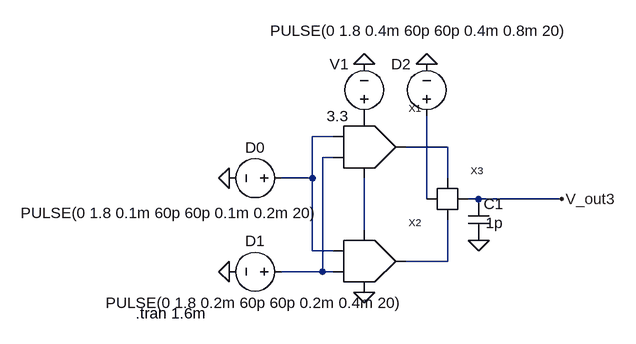
[diagram p0: schematic 3_bit_dac.asc]
3_bit_dac.asc, the LTspice schematic file:
Version 4
SHEET 1 880 680
WIRE 112 80 80 80
WIRE 288 96 224 96
WIRE 112 112 96 112
WIRE 80 144 80 80
WIRE 80 144 32 144
WIRE 288 144 288 96
WIRE 256 176 256 48
WIRE 336 176 320 176
WIRE 464 176 336 176
WIRE 160 224 160 144
WIRE 80 256 80 144
WIRE 112 256 80 256
WIRE 288 272 288 208
WIRE 288 272 224 272
WIRE 96 288 96 112
WIRE 96 288 32 288
WIRE 112 288 96 288
FLAG 160 -32 0
FLAG 160 320 0
FLAG -48 144 0
FLAG -48 288 0
FLAG 464 176 V_out3
FLAG 256 -32 0
FLAG 336 240 0
SYMBOL switch 288 176 R0
SYMATTR InstName X3
SYMBOL voltage 160 64 R180
WINDOW 0 24 96 Left 2
WINDOW 3 24 16 Left 2
WINDOW 123 0 0 Left 0
WINDOW 39 0 0 Left 0
SYMATTR InstName V1
SYMATTR Value 3.3
SYMBOL voltage 48 144 R90
WINDOW 0 -32 56 VBottom 2
WINDOW 3 38 187 VTop 2
WINDOW 123 0 0 Left 0
WINDOW 39 0 0 Left 0
SYMATTR InstName D0
SYMATTR Value PULSE(0 1.8 0.1m 60p 60p 0.1m 0.2m 20)
SYMBOL voltage 48 288 R90
WINDOW 0 -32 56 VBottom 2
WINDOW 3 32 56 VTop 2
WINDOW 123 0 0 Left 0
WINDOW 39 0 0 Left 0
SYMATTR InstName D1
SYMATTR Value PULSE(0 1.8 0.2m 60p 60p 0.2m 0.4m 20)
SYMBOL voltage 256 64 R180
WINDOW 0 24 96 Left 2
WINDOW 3 -218 147 Left 2
WINDOW 123 0 0 Left 0
WINDOW 39 0 0 Left 0
SYMATTR InstName D2
SYMATTR Value PULSE(0 1.8 0.4m 60p 60p 0.4m 0.8m 20)
SYMBOL cap 320 176 R0
WINDOW 3 27 37 Left 2
SYMATTR Value 1p
SYMATTR InstName C1
SYMBOL 2_bit_dac 160 96 R0
SYMATTR InstName X1
SYMBOL 2_bit_dac 160 272 R0
SYMATTR InstName X2
TEXT -192 352 Left 2 !.tran 1.6m

The netlist it stands for:
* 3_bit_dac.asc
XX3 N004 N002 N006 V_out3 switch  ; pins digital_input Vin_1 Vin_2 Vout
V1 P001 0 3.3
V§D0 N001 0 PULSE(0 1.8 0.1m 60p 60p 0.1m 0.2m 20)
V§D1 N003 0 PULSE(0 1.8 0.2m 60p 60p 0.2m 0.4m 20)
V§D2 N004 0 PULSE(0 1.8 0.4m 60p 60p 0.4m 0.8m 20)
C1 V_out3 0 1p
XX1 N001 N003 P001 N005 N002 2_bit_dac  ; pins D0 D1 R_in2 R_out2 V_out2
XX2 N001 N003 N005 0 N006 2_bit_dac  ; pins D0 D1 R_in2 R_out2 V_out2
.tran 1.6m
.backanno
.end